# EAGLE design test board (EAGLE 9.2.1)
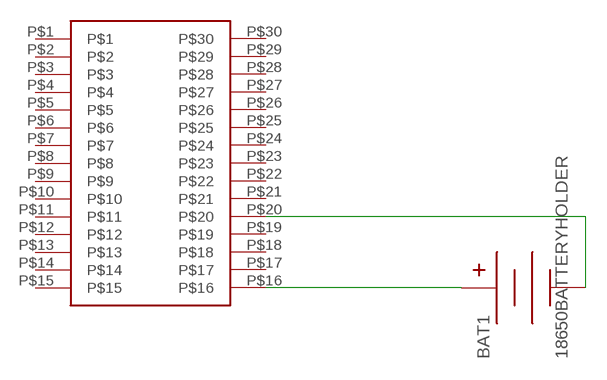
[diagram p0: schematic, sheet 1]

## Parts
BAT1  18650BATTERYHOLDER  [18650BATTERYHOLDER]
BQ78350-R1  BQ78350-R1  [TSSOP-30]

## Nets
N$1: BAT1.P$2(V+) BQ78350-R1.P$16
N$3: BAT1.P$1(V-) BQ78350-R1.P$20
Unconnected: BQ78350-R1.P$1 BQ78350-R1.P$2 BQ78350-R1.P$3 BQ78350-R1.P$4 BQ78350-R1.P$5 BQ78350-R1.P$6 BQ78350-R1.P$7 BQ78350-R1.P$8 BQ78350-R1.P$9 BQ78350-R1.P$10 BQ78350-R1.P$11 BQ78350-R1.P$12 BQ78350-R1.P$13 BQ78350-R1.P$14 BQ78350-R1.P$15 BQ78350-R1.P$17 BQ78350-R1.P$18 BQ78350-R1.P$19 BQ78350-R1.P$21 BQ78350-R1.P$22 BQ78350-R1.P$23 BQ78350-R1.P$24 BQ78350-R1.P$25 BQ78350-R1.P$26 BQ78350-R1.P$27 BQ78350-R1.P$28 BQ78350-R1.P$29 BQ78350-R1.P$30

## Library data of the parts
BAT1 = Hydro-Common-Comp:18650BATTERYHOLDER: 18650 Battery Holder Surface Mount Non Polarized.
BQ78350-R1 = Hydro-Common-Comp:BQ78350-R1

## Board
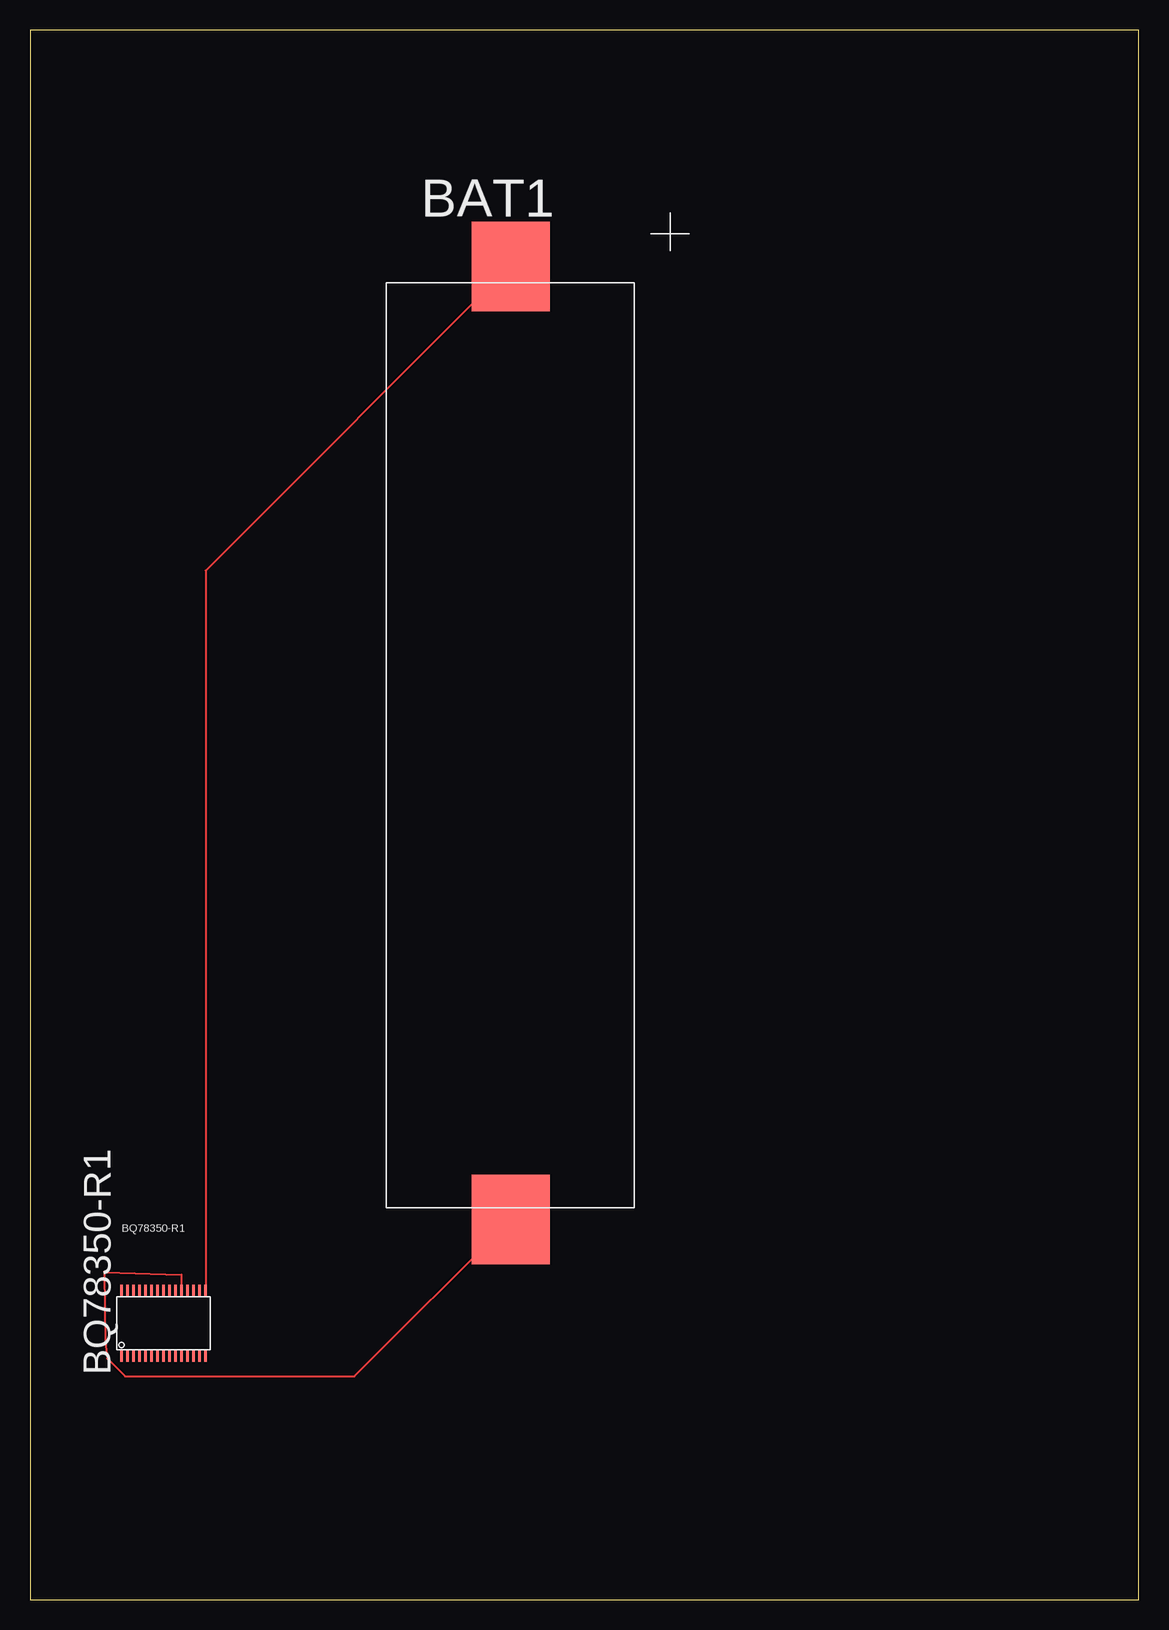
[diagram p1: board, top side]

Size 92.38 x 130.8 mm. Coordinates in mm from the lower left corner, seen from the top.
Outline: 0,0 92.38,0 92.38,130.8 0,130.8 0,0
Copper layers (1*16): Top 0.035mm / dielectric 1.5mm / Bottom 0.035mm
Design rules "default": minimum track width 6mil, minimum drill 0.35mm, track to track 6mil, track to pad 6mil, pad to pad 6mil, via to via 6mil, smd to smd 6mil, copper to edge 40mil, drill to drill 6mil, minimum pad ring 10mil, minimum via ring 8mil, stop-mask expansion 4mil, vias tented up to drill 0mil, thermal gap 10mil

### Footprints (pad centres in the part's own frame; a part is rotated, then mirrored left to right if it is on the bottom)
18650BATTERYHOLDER = smd 6.477 x 7.468: P$1 3.226,3.734; P$2 3.226,83.16
TSSOP-30 = smd 0.22 x 1: P$1 0,0; P$2 0.5,0; P$3 1,0; P$4 1.5,0; P$5 2,0; P$6 2.5,0; P$7 3,0; P$8 3.5,0; P$9 4,0; P$10 4.5,0; P$11 5,0; P$12 5.5,0; P$13 6,0; P$14 6.5,0; P$15 7,0; P$16 7,5.4; P$17 6.5,5.4; P$18 6,5.4; P$19 5.5,5.4; P$20 5,5.4; P$21 4.5,5.4; P$22 4,5.4; P$23 3.5,5.4; P$24 3,5.4; P$25 2.5,5.4; P$26 2,5.4; P$27 1.5,5.4; P$28 1,5.4; P$29 0.5,5.4; P$30 0,5.4

### Placement (x,y rotation side)
BAT1  36.83,27.94 0 top
BQ78350-R1  7.62,20.32 0 top

### Tracks (layer width: path | path; a pad name or v marks a point on that pad's centre or on a via)
N$1
  Top 0.152: BQ78350-R1.P$16 14.63,25.86 14.63,85.75 39.98,111.1 BAT1.P$2
N$3
  Top 0.152: 6.18,27.29 | 6.18,27.29 6.26,21.48 6.43,20.11 7.92,18.59 27.03,18.59 39.98,31.55 BAT1.P$1 | 6.18,27.29 12.62,27.09 BQ78350-R1.P$20